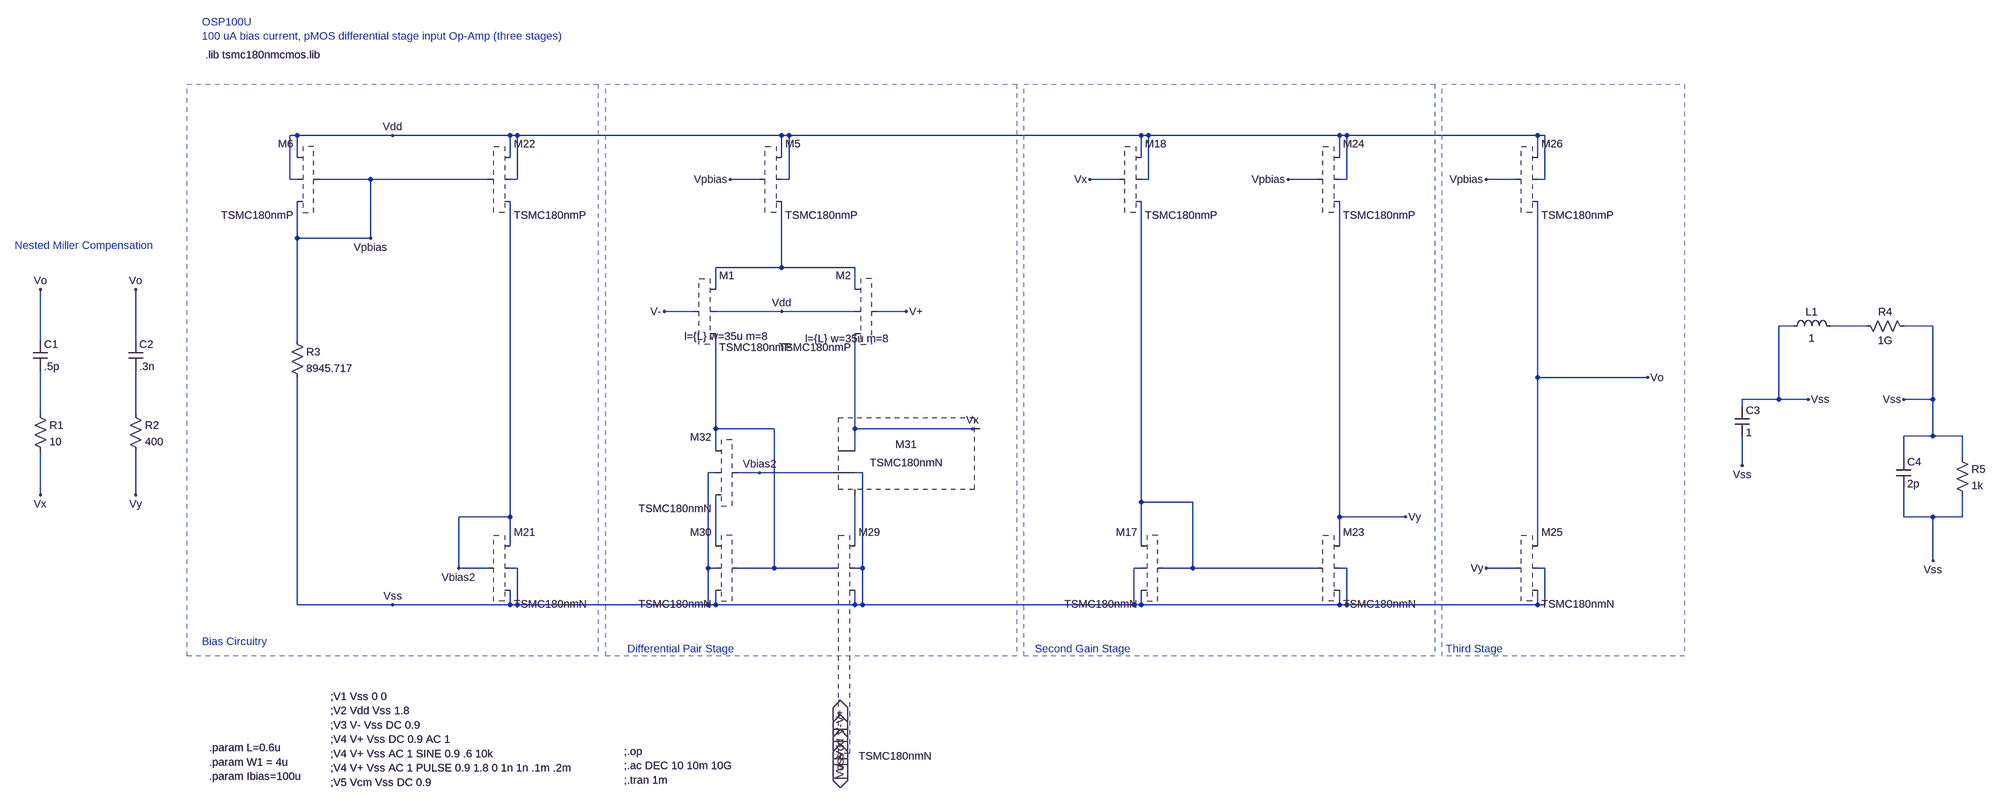
[diagram p0: schematic OSP100U.asc]
OSP100U.asc, the LTspice schematic file:
Version 4
SHEET 1 5428 1068
WIRE -1440 -432 -1456 -432
WIRE -1232 -432 -1440 -432
WIRE -976 -432 -1232 -432
WIRE -960 -432 -976 -432
WIRE -384 -432 -960 -432
WIRE -368 -432 -384 -432
WIRE 400 -432 -368 -432
WIRE 416 -432 400 -432
WIRE 832 -432 416 -432
WIRE 848 -432 832 -432
WIRE 1264 -432 848 -432
WIRE 1280 -432 1264 -432
WIRE -1440 -384 -1440 -432
WIRE -976 -384 -976 -432
WIRE -384 -384 -384 -432
WIRE 400 -384 400 -432
WIRE 832 -384 832 -432
WIRE 1264 -384 1264 -432
WIRE -1456 -336 -1456 -432
WIRE -1440 -336 -1456 -336
WIRE -1280 -336 -1392 -336
WIRE -1024 -336 -1280 -336
WIRE -960 -336 -960 -432
WIRE -960 -336 -976 -336
WIRE -432 -336 -496 -336
WIRE -368 -336 -368 -432
WIRE -368 -336 -384 -336
WIRE 352 -336 288 -336
WIRE 416 -336 416 -432
WIRE 416 -336 400 -336
WIRE 784 -336 720 -336
WIRE 848 -336 848 -432
WIRE 848 -336 832 -336
WIRE 1216 -336 1152 -336
WIRE 1280 -336 1280 -432
WIRE 1280 -336 1264 -336
WIRE -1440 -208 -1440 -288
WIRE -1280 -208 -1280 -336
WIRE -1280 -208 -1440 -208
WIRE -384 -144 -384 -288
WIRE -384 -144 -528 -144
WIRE -224 -144 -384 -144
WIRE -528 -96 -528 -144
WIRE -224 -96 -224 -144
WIRE -576 -48 -640 -48
WIRE -384 -48 -528 -48
WIRE -224 -48 -384 -48
WIRE -112 -48 -176 -48
WIRE 2192 -16 2160 -16
WIRE 2352 -16 2272 -16
WIRE 2496 -16 2432 -16
WIRE -2000 16 -2000 -96
WIRE -1792 16 -1792 -96
WIRE -1440 16 -1440 -208
WIRE 1264 96 1264 -288
WIRE 1504 96 1264 96
WIRE 2160 144 2160 -16
WIRE 2160 144 2080 144
WIRE 2224 144 2160 144
WIRE 2496 144 2496 -16
WIRE 2496 144 2432 144
WIRE 2080 160 2080 144
WIRE -2000 176 -2000 80
WIRE -1792 176 -1792 80
WIRE -528 208 -528 0
WIRE -400 208 -528 208
WIRE -224 208 -224 0
WIRE 32 208 -224 208
WIRE 48 208 32 208
WIRE 2496 224 2496 144
WIRE 2496 224 2432 224
WIRE 2560 224 2496 224
WIRE -528 256 -528 208
WIRE -224 256 -224 208
WIRE 2432 272 2432 224
WIRE 2560 272 2560 224
WIRE 2080 288 2080 224
WIRE -528 304 -544 304
WIRE -432 304 -480 304
WIRE -272 304 -432 304
WIRE -208 304 -224 304
WIRE -2000 352 -2000 256
WIRE -1792 352 -1792 256
WIRE 400 368 400 -288
WIRE 512 368 400 368
WIRE -976 400 -976 -288
WIRE -976 400 -1088 400
WIRE 832 400 832 -288
WIRE 976 400 832 400
WIRE 2432 400 2432 336
WIRE 2496 400 2432 400
WIRE 2560 400 2560 352
WIRE 2560 400 2496 400
WIRE -976 464 -976 400
WIRE -528 464 -528 352
WIRE -224 464 -224 352
WIRE 400 464 400 368
WIRE 832 464 832 400
WIRE 1264 464 1264 96
WIRE 2496 496 2496 400
WIRE -1088 512 -1088 400
WIRE -1024 512 -1088 512
WIRE -960 512 -976 512
WIRE -544 512 -544 304
WIRE -528 512 -544 512
WIRE -400 512 -400 208
WIRE -400 512 -480 512
WIRE -272 512 -400 512
WIRE -208 512 -208 304
WIRE -208 512 -224 512
WIRE 400 512 384 512
WIRE 512 512 512 368
WIRE 512 512 448 512
WIRE 784 512 512 512
WIRE 848 512 832 512
WIRE 1216 512 1152 512
WIRE 1280 512 1264 512
WIRE -1440 592 -1440 96
WIRE -1232 592 -1440 592
WIRE -976 592 -976 560
WIRE -976 592 -1232 592
WIRE -960 592 -960 512
WIRE -960 592 -976 592
WIRE -544 592 -544 512
WIRE -544 592 -960 592
WIRE -528 592 -528 560
WIRE -528 592 -544 592
WIRE -224 592 -224 560
WIRE -224 592 -528 592
WIRE -208 592 -208 512
WIRE -208 592 -224 592
WIRE 384 592 384 512
WIRE 384 592 -208 592
WIRE 400 592 400 560
WIRE 400 592 384 592
WIRE 832 592 832 560
WIRE 832 592 400 592
WIRE 848 592 848 512
WIRE 848 592 832 592
WIRE 1264 592 1264 560
WIRE 1264 592 848 592
WIRE 1280 592 1280 512
WIRE 1280 592 1264 592
FLAG -1232 -432 Vdd
FLAG -384 -48 Vdd
FLAG -640 -48 V-
FLAG -112 -48 V+
FLAG -1280 -208 Vpbias
FLAG -496 -336 Vpbias
FLAG 288 -336 Vx
FLAG -1088 512 Vbias2
FLAG 720 -336 Vpbias
FLAG 1152 -336 Vpbias
FLAG 976 400 Vy
FLAG 1152 512 Vy
FLAG 1504 96 Vo
FLAG -2000 -96 Vo
FLAG -2000 352 Vx
FLAG -1792 -96 Vo
FLAG -1792 352 Vy
FLAG -432 304 Vbias2
FLAG 32 208 Vx
FLAG -1232 592 Vss
FLAG -256 800 V+
IOPIN -256 800 In
FLAG -256 832 V-
IOPIN -256 832 In
FLAG -256 864 Vdd
IOPIN -256 864 In
FLAG -256 896 Vss
IOPIN -256 896 In
FLAG -256 928 Vo
IOPIN -256 928 Out
FLAG 2080 288 Vss
FLAG 2432 144 Vss
FLAG 2224 144 Vss
FLAG 2496 496 Vss
DATAFLAG 32 -432 ""
DATAFLAG -144 -48 ""
DATAFLAG -608 -48 ""
DATAFLAG -288 -144 ""
DATAFLAG -1216 -336 ""
DATAFLAG -976 80 ""
DATAFLAG 880 400 ""
DATAFLAG 1344 96 ""
DATAFLAG -96 208 ""
DATAFLAG 96 592 ""
DATAFLAG 2544 224 ""
DATAFLAG -1440 -80 "Id(M6)"
DATAFLAG -976 -112 "Id(M22)"
DATAFLAG -528 112 "Id(M1)"
DATAFLAG 400 -176 "Id(M18)"
DATAFLAG 400 192 ""
DATAFLAG 832 -176 "Id(M24)"
DATAFLAG 1264 -192 "Id(M26)"
DATAFLAG -224 112 "Id(M2)"
DATAFLAG -384 -224 "Id(M5)"
DATAFLAG -448 208 ""
DATAFLAG -1040 400 ""
DATAFLAG -320 304 ""
SYMBOL pmos_t18 -576 -96 R0
WINDOW 123 -20 102 Left 2
SYMATTR Value2 l={L} w=35u m=8
SYMATTR InstName M1
SYMATTR SpiceLine ""
SYMATTR SpiceModel ""
SYMATTR Value TSMC180nmP
SYMBOL pmos_t18 -176 -96 M0
WINDOW 123 -26 107 Left 2
SYMATTR Value2 l={L} w=35u m=8
SYMATTR InstName M2
SYMATTR SpiceLine ""
SYMATTR SpiceModel ""
SYMATTR Value TSMC180nmP
SYMBOL pmos_t18 -432 -384 R0
SYMATTR InstName M5
SYMATTR Value2 l={L} w=30u
SYMATTR SpiceLine ""
SYMATTR SpiceModel ""
SYMATTR Value TSMC180nmP
SYMBOL pmos_t18 -1392 -384 M0
SYMATTR InstName M6
SYMATTR Value2 l={L} w=10u
SYMATTR SpiceLine ""
SYMATTR SpiceModel ""
SYMATTR Value TSMC180nmP
SYMBOL nmos_t18 448 464 M0
SYMATTR InstName M17
SYMATTR Value2 l={L} w=10u
SYMATTR SpiceLine ""
SYMATTR SpiceModel ""
SYMATTR Value TSMC180nmN
SYMBOL pmos_t18 352 -384 R0
SYMATTR InstName M18
SYMATTR Value2 l={L} w=10u
SYMATTR SpiceLine ""
SYMATTR SpiceModel ""
SYMATTR Value TSMC180nmP
SYMBOL nmos_t18 -1024 464 R0
SYMATTR InstName M21
SYMATTR Value2 l={L} w=1u
SYMATTR SpiceLine ""
SYMATTR SpiceModel ""
SYMATTR Value TSMC180nmN
SYMBOL pmos_t18 -1024 -384 R0
SYMATTR InstName M22
SYMATTR Value2 l={L} w=10u
SYMATTR SpiceLine ""
SYMATTR SpiceModel ""
SYMATTR Value TSMC180nmP
SYMBOL nmos_t18 784 464 R0
SYMATTR InstName M23
SYMATTR Value2 l={L} w=10u
SYMATTR SpiceLine ""
SYMATTR SpiceModel ""
SYMATTR Value TSMC180nmN
SYMBOL pmos_t18 784 -384 R0
SYMATTR InstName M24
SYMATTR Value2 l={L} w=9.79u
SYMATTR SpiceLine ""
SYMATTR SpiceModel ""
SYMATTR Value TSMC180nmP
SYMBOL nmos_t18 1216 464 R0
SYMATTR InstName M25
SYMATTR Value2 l={L} w=19u m=4
SYMATTR SpiceLine ""
SYMATTR SpiceModel ""
SYMATTR Value TSMC180nmN
SYMBOL pmos_t18 1216 -384 R0
SYMATTR InstName M26
SYMATTR Value2 l={L} w=37.2u m=10
SYMATTR SpiceLine ""
SYMATTR SpiceModel ""
SYMATTR Value TSMC180nmP
SYMBOL cap -2016 16 R0
SYMATTR InstName C1
SYMATTR Value .5p
SYMBOL cap -1808 16 R0
SYMATTR InstName C2
SYMATTR Value .3n
SYMBOL nmos_t18 -272 464 R0
SYMATTR InstName M29
SYMATTR Value2 l={L} w={W1}
SYMATTR SpiceLine ""
SYMATTR SpiceModel ""
SYMATTR Value TSMC180nmN
SYMBOL nmos_t18 -480 464 M0
SYMATTR InstName M30
SYMATTR Value2 l={L} w={W1}
SYMATTR SpiceLine ""
SYMATTR SpiceModel ""
SYMATTR Value TSMC180nmN
SYMBOL nmos_t18 -272 256 R0
SYMATTR InstName M31
SYMATTR Value2 l={L} w={W1}
SYMATTR SpiceLine ""
SYMATTR SpiceModel ""
SYMATTR Value TSMC180nmN
SYMBOL nmos_t18 -480 256 M0
SYMATTR InstName M32
SYMATTR Value2 l={L} w={W1}
SYMATTR SpiceLine ""
SYMATTR SpiceModel ""
SYMATTR Value TSMC180nmN
SYMBOL res -2016 160 R0
SYMATTR InstName R1
SYMATTR Value 10
SYMBOL res -1808 160 R0
SYMATTR InstName R2
SYMATTR Value 400
SYMBOL res -1456 0 R0
SYMATTR InstName R3
SYMATTR Value 8945.717
SYMBOL res 2336 -32 M90
WINDOW 0 0 56 VBottom 2
WINDOW 3 32 56 VTop 2
SYMATTR InstName R4
SYMATTR Value 1G
SYMBOL cap 2064 160 R0
SYMATTR InstName C3
SYMATTR Value 1
SYMBOL ind 2288 0 M270
WINDOW 0 32 56 VTop 2
WINDOW 3 5 56 VBottom 2
SYMATTR InstName L1
SYMATTR Value 1
SYMBOL cap 2416 272 R0
SYMATTR InstName C4
SYMATTR Value 2p
SYMBOL res 2544 256 R0
SYMATTR InstName R5
SYMATTR Value 1k
TEXT -1632 904 Left 2 !.param L=0.6u\n.param W1 = 4u\n.param Ibias=100u
TEXT -1640 -608 Left 2 !.lib tsmc180nmcmos.lib
TEXT -1368 792 Left 2 !;V1 Vss 0 0\n;V2 Vdd Vss 1.8\n;V3 V- Vss DC 0.9\n;V4 V+ Vss DC 0.9 AC 1\n;V4 V+ Vss AC 1 SINE 0.9 .6 10k\n;V4 V+ Vss AC 1 PULSE 0.9 1.8 0 1n 1n .1m .2m\n;V5 Vcm Vss DC 0.9
TEXT -1648 -680 Left 2 ;OSP100U\n100 uA bias current, pMOS differential stage input Op-Amp (three stages)
TEXT -728 912 Left 2 !;.op\n;.ac DEC 10 10m 10G\n;.tran 1m
TEXT -2056 -192 Left 2 ;Nested Miller Compensation
TEXT -1648 672 Left 2 ;Bias Circuitry
TEXT -720 688 Left 2 ;Differential Pair Stage
TEXT 168 688 Left 2 ;Second Gain Stage
TEXT 1064 688 Left 2 ;Third Stage
RECTANGLE Normal 128 704 -768 -544 2
RECTANGLE Normal 1040 704 144 -544 2
RECTANGLE Normal 1584 704 1056 -544 2
RECTANGLE Normal -784 704 -1680 -544 2

The netlist it stands for:
* OSP100U.asc
* M1: TSMC180nmP l={L} w=35u m=8 (symbol pmos_t18 not available, pin order unknown); nets seen at it: N001, N005, V-, Vdd
* M2: TSMC180nmP l={L} w=35u m=8 (symbol pmos_t18 not available, pin order unknown); nets seen at it: N001, V+, Vdd, Vx
* M5: TSMC180nmP l={L} w=30u (symbol pmos_t18 not available, pin order unknown); nets seen at it: N001, Vdd, Vpbias
* M6: TSMC180nmP l={L} w=10u (symbol pmos_t18 not available, pin order unknown); nets seen at it: Vdd, Vpbias
* M17: TSMC180nmN l={L} w=10u (symbol nmos_t18 not available, pin order unknown); nets seen at it: N006, Vss
* M18: TSMC180nmP l={L} w=10u (symbol pmos_t18 not available, pin order unknown); nets seen at it: N006, Vdd, Vx
* M21: TSMC180nmN l={L} w=1u (symbol nmos_t18 not available, pin order unknown); nets seen at it: Vbias2, Vss
* M22: TSMC180nmP l={L} w=10u (symbol pmos_t18 not available, pin order unknown); nets seen at it: Vbias2, Vdd, Vpbias
* M23: TSMC180nmN l={L} w=10u (symbol nmos_t18 not available, pin order unknown); nets seen at it: N006, Vss, Vy
* M24: TSMC180nmP l={L} w=9.79u (symbol pmos_t18 not available, pin order unknown); nets seen at it: Vdd, Vpbias, Vy
* M25: TSMC180nmN l={L} w=19u m=4 (symbol nmos_t18 not available, pin order unknown); nets seen at it: Vo, Vss, Vy
* M26: TSMC180nmP l={L} w=37.2u m=10 (symbol pmos_t18 not available, pin order unknown); nets seen at it: Vdd, Vo, Vpbias
C1 Vo N003 .5p
C2 Vo N004 .3n
* M29: TSMC180nmN l={L} w={W1} (symbol nmos_t18 not available, pin order unknown); nets seen at it: N005, N008, V+, V-, Vdd, Vo, Vss
* M30: TSMC180nmN l={L} w={W1} (symbol nmos_t18 not available, pin order unknown); nets seen at it: N005, N007, Vss
* M31: TSMC180nmN l={L} w={W1} (symbol nmos_t18 not available, pin order unknown); nets seen at it: N008, Vbias2, Vss, Vx
* M32: TSMC180nmN l={L} w={W1} (symbol nmos_t18 not available, pin order unknown); nets seen at it: N005, N007, Vbias2, Vss
R1 N003 Vx 10
R2 N004 Vy 400
R3 Vpbias Vss 8945.717
R4 N002 Vss 1G
C3 Vss Vss 1
L1 N002 Vss 1
C4 Vss Vss 2p
R5 Vss Vss 1k
.param L=0.6u
.param W1 = 4u
.param Ibias=100u
.lib tsmc180nmcmos.lib
;V1 Vss 0 0
;V2 Vdd Vss 1.8
;V3 V- Vss DC 0.9
;V4 V+ Vss DC 0.9 AC 1
;V4 V+ Vss AC 1 SINE 0.9 .6 10k
;V4 V+ Vss AC 1 PULSE 0.9 1.8 0 1n 1n .1m .2m
;V5 Vcm Vss DC 0.9
* OSP100U
* 100 uA bias current, pMOS differential stage input Op-Amp (three stages)
;.op
;.ac DEC 10 10m 10G
;.tran 1m
* Nested Miller Compensation
* Bias Circuitry
* Differential Pair Stage
* Second Gain Stage
* Third Stage
.backanno
.end